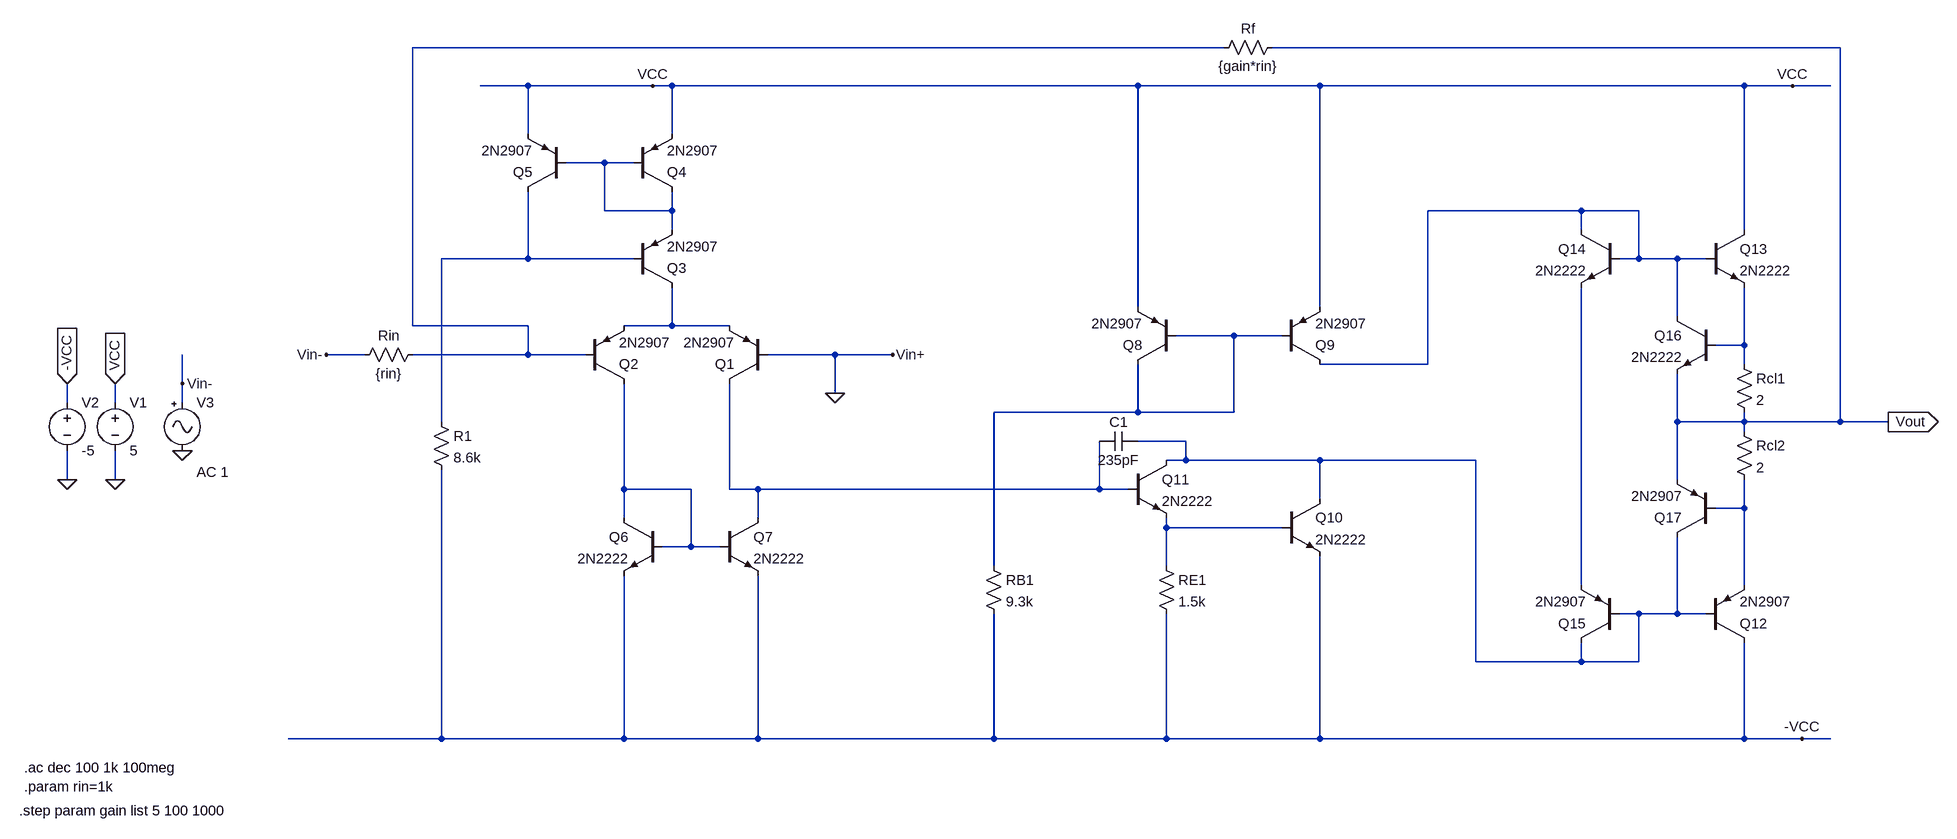
[diagram p0: schematic block4.asc]
block4.asc, the LTspice schematic file:
Version 4
SHEET 1 1840 1240
WIRE 464 -384 -912 -384
WIRE 1648 -384 544 -384
WIRE -720 -320 -800 -320
WIRE -512 -320 -720 -320
WIRE -480 -320 -512 -320
WIRE 320 -320 -480 -320
WIRE 624 -320 320 -320
WIRE 1488 -320 624 -320
WIRE 1568 -320 1488 -320
WIRE 1632 -320 1568 -320
WIRE -720 -240 -720 -320
WIRE -480 -240 -480 -320
WIRE -592 -192 -656 -192
WIRE -544 -192 -592 -192
WIRE -592 -112 -592 -192
WIRE -480 -112 -480 -144
WIRE -480 -112 -592 -112
WIRE 1216 -112 960 -112
WIRE 1312 -112 1216 -112
WIRE -480 -80 -480 -112
WIRE 1216 -80 1216 -112
WIRE 1488 -80 1488 -320
WIRE -720 -32 -720 -144
WIRE -720 -32 -864 -32
WIRE -544 -32 -720 -32
WIRE 1312 -32 1312 -112
WIRE 1312 -32 1280 -32
WIRE 1376 -32 1312 -32
WIRE 1424 -32 1376 -32
WIRE 320 48 320 -320
WIRE 624 48 624 -320
WIRE 1376 64 1376 -32
WIRE -912 80 -912 -384
WIRE -720 80 -912 80
WIRE -480 80 -480 16
WIRE -480 80 -560 80
WIRE -384 80 -480 80
WIRE 480 96 384 96
WIRE 560 96 480 96
WIRE 1488 112 1488 16
WIRE 1488 112 1440 112
WIRE -992 128 -1056 128
WIRE -720 128 -720 80
WIRE -720 128 -912 128
WIRE -624 128 -720 128
WIRE -208 128 -320 128
WIRE -112 128 -208 128
WIRE 960 144 960 -112
WIRE 960 144 624 144
WIRE 1488 144 1488 112
WIRE -1376 176 -1376 128
WIRE -208 192 -208 128
WIRE -1568 208 -1568 176
WIRE -1488 208 -1488 176
WIRE -1376 208 -1376 176
WIRE 320 224 320 144
WIRE 320 224 80 224
WIRE 480 224 480 96
WIRE 480 224 320 224
WIRE -864 240 -864 -32
WIRE 1376 240 1376 160
WIRE 1488 240 1488 224
WIRE 1488 240 1376 240
WIRE 1648 240 1648 -384
WIRE 1648 240 1488 240
WIRE 1728 240 1648 240
WIRE 1488 256 1488 240
WIRE 400 272 320 272
WIRE 400 304 400 272
WIRE 400 304 368 304
WIRE 624 304 400 304
WIRE 1040 304 624 304
WIRE -1568 336 -1568 288
WIRE -1488 336 -1488 288
WIRE 1376 336 1376 240
WIRE -560 352 -560 176
WIRE -448 352 -560 352
WIRE -384 352 -384 176
WIRE -336 352 -384 352
WIRE 256 352 256 272
WIRE 256 352 -336 352
WIRE 304 352 256 352
WIRE 624 368 624 304
WIRE 1488 384 1488 336
WIRE 1488 384 1440 384
WIRE -560 400 -560 352
WIRE -336 400 -336 352
WIRE 368 416 368 400
WIRE 560 416 368 416
WIRE -448 448 -448 352
WIRE -448 448 -496 448
WIRE -400 448 -448 448
WIRE 80 480 80 224
WIRE 368 480 368 416
WIRE 1216 512 1216 16
WIRE 1488 512 1488 384
WIRE 1312 560 1280 560
WIRE 1376 560 1376 432
WIRE 1376 560 1312 560
WIRE 1424 560 1376 560
WIRE 1040 640 1040 304
WIRE 1216 640 1216 608
WIRE 1216 640 1040 640
WIRE 1312 640 1312 560
WIRE 1312 640 1216 640
WIRE -864 768 -864 320
WIRE -864 768 -1120 768
WIRE -560 768 -560 496
WIRE -560 768 -864 768
WIRE -336 768 -336 496
WIRE -336 768 -560 768
WIRE 80 768 80 560
WIRE 80 768 -336 768
WIRE 368 768 368 560
WIRE 368 768 80 768
WIRE 624 768 624 464
WIRE 624 768 368 768
WIRE 1488 768 1488 608
WIRE 1488 768 624 768
WIRE 1584 768 1488 768
WIRE 1632 768 1584 768
FLAG -1488 336 0
FLAG -1568 336 0
FLAG -1488 176 VCC
IOPIN -1488 176 In
FLAG -1568 176 -VCC
IOPIN -1568 176 In
FLAG -512 -320 VCC
FLAG -1056 128 Vin-
FLAG 1728 240 Vout
IOPIN 1728 240 Out
FLAG 1568 -320 VCC
FLAG 1584 768 -VCC
FLAG -1376 288 0
FLAG -1376 176 Vin-
FLAG -208 192 0
FLAG -112 128 Vin+
SYMBOL pnp -320 176 R180
SYMATTR InstName Q1
SYMATTR Value 2N2907
SYMBOL pnp -624 176 M180
SYMATTR InstName Q2
SYMATTR Value 2N2907
SYMBOL voltage -1488 192 R0
SYMATTR InstName V1
SYMATTR Value 5
SYMBOL voltage -1568 192 R0
SYMATTR InstName V2
SYMATTR Value -5
SYMBOL pnp -544 16 M180
SYMATTR InstName Q3
SYMATTR Value 2N2907
SYMBOL pnp -544 -144 M180
SYMATTR InstName Q4
SYMATTR Value 2N2907
SYMBOL pnp -656 -144 R180
SYMATTR InstName Q5
SYMATTR Value 2N2907
SYMBOL res -880 224 R0
SYMATTR InstName R1
SYMATTR Value 8.6k
SYMBOL npn -496 400 M0
SYMATTR InstName Q6
SYMATTR Value 2N2222
SYMBOL npn -400 400 R0
SYMATTR InstName Q7
SYMATTR Value 2N2222
SYMBOL res 64 464 R0
SYMATTR InstName RB1
SYMATTR Value 9.3k
SYMBOL pnp 384 144 R180
SYMATTR InstName Q8
SYMATTR Value 2N2907
SYMBOL pnp 560 144 M180
SYMATTR InstName Q9
SYMATTR Value 2N2907
SYMBOL npn 560 368 R0
SYMATTR InstName Q10
SYMATTR Value 2N2222
SYMBOL npn 304 304 R0
SYMATTR InstName Q11
SYMATTR Value 2N2222
SYMBOL res 352 464 R0
SYMATTR InstName RE1
SYMATTR Value 1.5k
SYMBOL pnp 1424 608 M180
SYMATTR InstName Q12
SYMATTR Value 2N2907
SYMBOL npn 1424 -80 R0
SYMATTR InstName Q13
SYMATTR Value 2N2222
SYMBOL npn 1280 -80 M0
SYMATTR InstName Q14
SYMATTR Value 2N2222
SYMBOL pnp 1280 608 R180
SYMATTR InstName Q15
SYMATTR Value 2N2907
SYMBOL npn 1440 64 M0
SYMATTR InstName Q16
SYMATTR Value 2N2222
SYMBOL pnp 1440 432 R180
SYMATTR InstName Q17
SYMATTR Value 2N2907
SYMBOL res 1472 128 R0
SYMATTR InstName Rcl1
SYMATTR Value 2
SYMBOL res 1472 240 R0
SYMATTR InstName Rcl2
SYMATTR Value 2
SYMBOL Misc\\signal -1376 192 R0
WINDOW 123 24 132 Left 2
WINDOW 39 0 0 Left 0
SYMATTR Value2 AC 1
SYMATTR InstName V3
SYMATTR Value ""
SYMBOL cap 320 256 R90
WINDOW 0 0 32 VBottom 2
WINDOW 3 32 32 VTop 2
SYMATTR InstName C1
SYMATTR Value 235pF
SYMBOL res 560 -400 R90
WINDOW 0 0 56 VBottom 2
WINDOW 3 32 56 VTop 2
SYMATTR InstName Rf
SYMATTR Value {gain*rin}
SYMBOL res -896 112 R90
WINDOW 0 0 56 VBottom 2
WINDOW 3 32 56 VTop 2
SYMATTR InstName Rin
SYMATTR Value {rin}
TEXT -1640 816 Left 2 !.ac dec 100 1k 100meg
TEXT -1640 848 Left 2 !.param rin=1k
TEXT -1648 888 Left 2 !.step param gain list 5 100 1000

The netlist it stands for:
* block4.asc
Q1 N010 0 N005 0 2N2907
Q2 N009 N001 N005 0 2N2907
V1 VCC 0 5
V2 -VCC 0 -5
Q3 N005 N004 N002 0 2N2907
Q4 N002 N002 VCC 0 2N2907
Q5 N004 N002 VCC 0 2N2907
R1 N004 -VCC 8.6k
Q6 N009 N009 -VCC 0 2N2222
Q7 N010 N009 -VCC 0 2N2222
RB1 N006 -VCC 9.3k
Q8 N006 N006 VCC 0 2N2907
Q9 N003 N006 VCC 0 2N2907
Q10 N008 N012 -VCC 0 2N2222
Q11 N008 N010 N012 0 2N2222
RE1 N012 -VCC 1.5k
Q12 -VCC N008 N011 0 2N2907
Q13 VCC N003 N007 0 2N2222
Q14 N003 N003 N013 0 2N2222
Q15 N008 N008 N013 0 2N2907
Q16 N003 N007 Vout 0 2N2222
Q17 N008 N011 Vout 0 2N2907
Rcl1 N007 Vout 2
Rcl2 Vout N011 2
V3 Vin- 0 AC 1
C1 N008 N010 235pF
Rf Vout N001 {gain*rin}
Rin N001 Vin- {rin}
.model NPN NPN
.model PNP PNP
.lib standard.bjt
.ac dec 100 1k 100meg
.param rin=1k
.step param gain list 5 100 1000
.backanno
.end